# Altium schematic sheet SURFACE.SchDoc
size A4; SheetNumber: 2; SheetTotal: 5
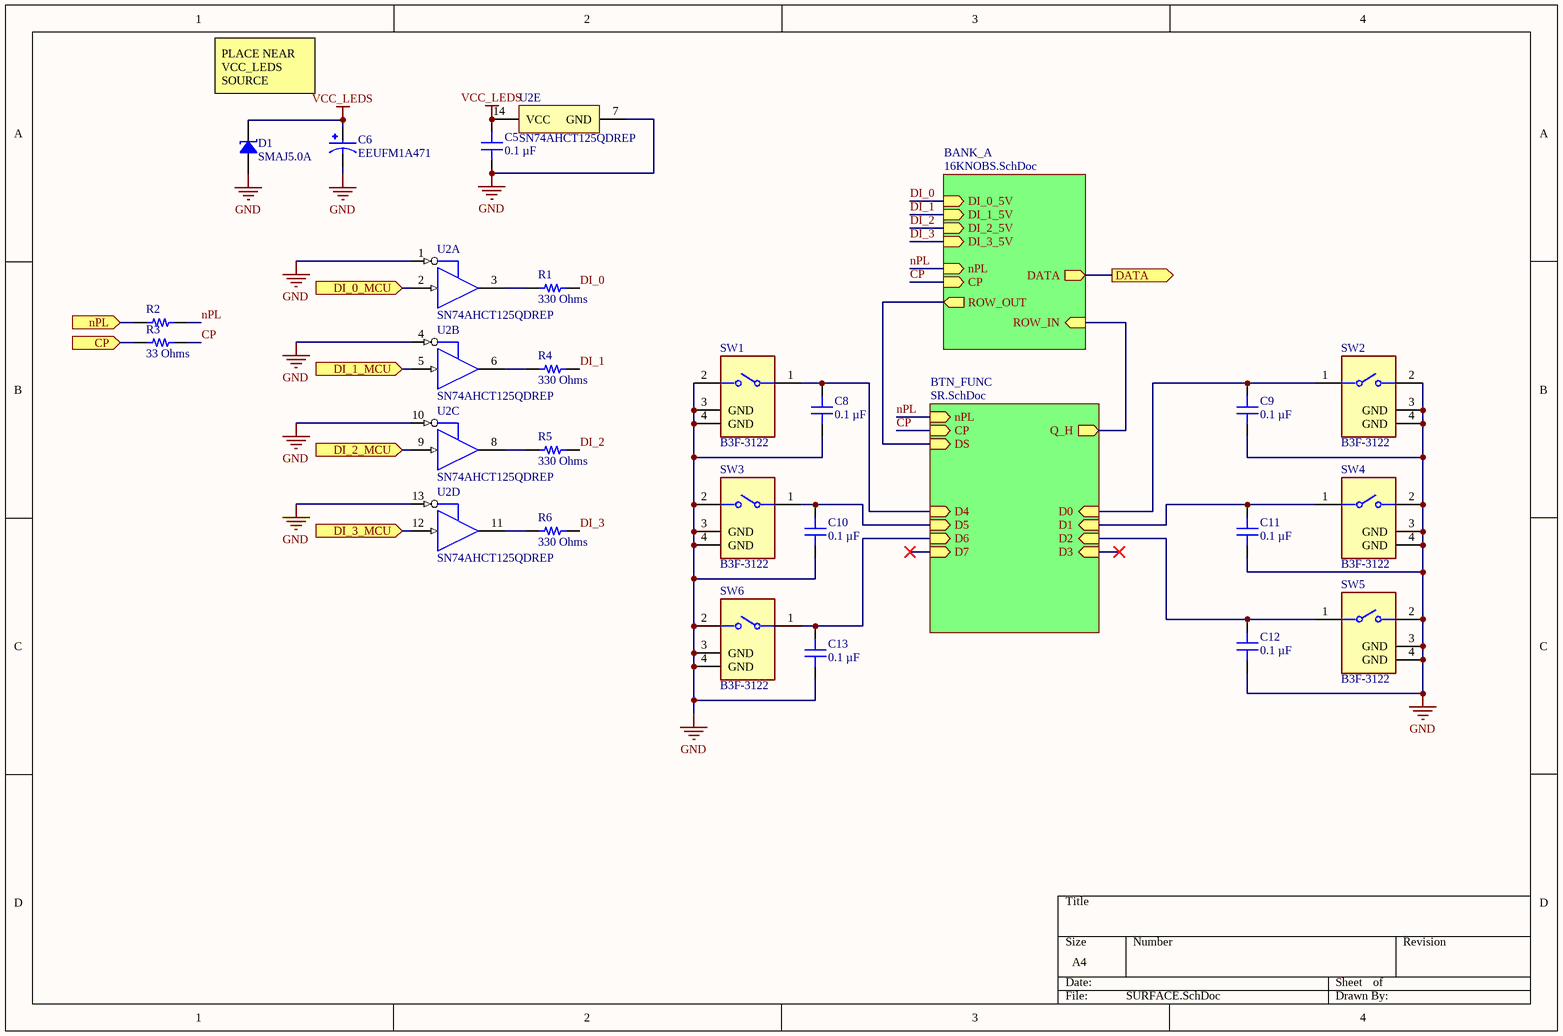
[diagram p0: SURFACE.SchDoc]

## Parts
C5  0.1 µF  [CAP 0603_1608]
C6  EEUFM1A471  [CAPPRD350W60D800H1150]
C8  0.1 µF  [CAP 0603_1608]
C9  0.1 µF  [CAP 0603_1608]
C10  0.1 µF  [CAP 0603_1608]
C11  0.1 µF  [CAP 0603_1608]
C12  0.1 µF  [CAP 0603_1608]
C13  0.1 µF  [CAP 0603_1608]
D1  SMAJ5.0A  [DO214AC SMA]
R1  330 Ohms  [YAGEO RES 0603_1608]
R2  33 Ohms  [YAGEO RES 0603_1608]  (value not drawn)
R3  33 Ohms  [YAGEO RES 0603_1608]
R4  330 Ohms  [YAGEO RES 0603_1608]
R5  330 Ohms  [YAGEO RES 0603_1608]
R6  330 Ohms  [YAGEO RES 0603_1608]
SW1  B3F-3122  [FP-B3F-3122-MFG]
SW2  B3F-3122  [FP-B3F-3122-MFG]
SW3  B3F-3122  [FP-B3F-3122-MFG]
SW4  B3F-3122  [FP-B3F-3122-MFG]
SW5  B3F-3122  [FP-B3F-3122-MFG]
SW6  B3F-3122  [FP-B3F-3122-MFG]
U2  SN74AHCT125QDREP  [D0014A_L]  (parts A,B,C,D,E of 5)

## Sub-sheets
BANK_A = 16KNOBS.SchDoc: DI_0_5V (in), DI_1_5V (in), nPL (in), CP (in), DI_2_5V (in), DI_3_5V (in), DATA (out), ROW_IN (in), ROW_OUT (out)
BTN_FUNC = SR.SchDoc: nPL (in), CP (in), DS (in), Q_H (out), D4 (in), D5 (in), D6 (in), D7 (in), D0 (in), D1 (in), D2 (in), D3 (in)

## Ports
CP (in), DATA (out), DI_0_MCU (in), DI_1_MCU (in), DI_2_MCU (in), DI_3_MCU (in), nPL (in)

## Nets
GND: C5.1 C6.N C8.1 C9.1 C10.1 C11.1 C12.1 C13.1 D1.1 SW1.2 SW1.3(GND) SW1.4(GND) SW2.2 SW2.3(GND) SW2.4(GND) SW3.2 SW3.3(GND) SW3.4(GND) SW4.2 SW4.3(GND) SW4.4(GND) SW5.2 SW5.3(GND) SW5.4(GND) SW6.2 SW6.3(GND) SW6.4(GND) U2.1(1~{OE}) U2.4(2~{OE}) U2.7(GND) U2.10(3~{OE}) U2.13(4~{OE})
VCC_LEDS: C5.2 C6.P D1.2 U2.14(VCC)
CP: R3.2 ; sheet BTN_FUNC/CP, sheet BANK_A/CP
CP: R3.1 ; port CP  [a separate net that carries the same name]
DATA: port DATA, sheet BANK_A/DATA
DI_0: R1.2 ; sheet BANK_A/DI_0_5V
DI_0_MCU: U2.2(1A) ; port DI_0_MCU
DI_1: R4.2 ; sheet BANK_A/DI_1_5V
DI_1_MCU: U2.5(2A) ; port DI_1_MCU
DI_2: R5.2 ; sheet BANK_A/DI_2_5V
DI_2_MCU: U2.9(3A) ; port DI_2_MCU
DI_3: R6.2 ; sheet BANK_A/DI_3_5V
DI_3_MCU: U2.12(4A) ; port DI_3_MCU
nPL: R2.2 ; sheet BTN_FUNC/nPL, sheet BANK_A/nPL
nPL: R2.1 ; port nPL  [a separate net that carries the same name]
NetC8_2: C8.2 SW1.1 ; sheet BTN_FUNC/D4
NetC9_2: C9.2 SW2.1 ; sheet BTN_FUNC/D0
NetC10_2: C10.2 SW3.1 ; sheet BTN_FUNC/D5
NetC11_2: C11.2 SW4.1 ; sheet BTN_FUNC/D1
NetC12_2: C12.2 SW5.1 ; sheet BTN_FUNC/D2
NetC13_2: C13.2 SW6.1 ; sheet BTN_FUNC/D6
NetR1_1: R1.1 U2.3(1Y)
NetR4_1: R4.1 U2.6(2Y)
NetR5_1: R5.1 U2.8(3Y)
NetR6_1: R6.1 U2.11(4Y)
(unnamed): sheet BTN_FUNC/DS, sheet BANK_A/ROW_OUT
(unnamed): sheet BTN_FUNC/Q_H, sheet BANK_A/ROW_IN

## Notes on the sheet
- PLACE NEAR
  VCC_LEDS SOURCE

## Library data of the parts
C5 C8-C13 = CC0603KPX7R7BB104: CAP CER 0.1UF 16V X7R 0603; manufacturer: Yageo; Tolerance: ±10%; Part Number: CC0603KPX7R7BB104; Value: 0.1 µF; Applications: General Purpose; Capacitance: 0.1 µF; componentlink1description: Datasheet; componentlink1url: https://www.yageo.com/upload/media/product/productsearch/datasheet/mlcc/UPY-GPHC_X7R_6.3V-to-50V_18.pdf; componentlink2description: DigiKey Link; componentlink2url: https://www.digikey.com/en/products/detail/yageo/CC0603KPX7R7BB104/2103073; Device Package: 0603 (1608 Metric); lastupdated: 2/9/2024 8:10:09 PM; Lifecycle Status: Active; Minimum Order: 1; Mounting Type: Surface Mount, MLCC; Operating Temperature: -55°C ~ 125°C; Package / Case: 0603 (1608 Metric); packaging: TapeAndReel; partid: 16718; Part Status: Active; price: 0.01; series: CC; Size / Dimension: 0.063" L x 0.031" W (1.60mm x 0.80mm); Supplier 1: DigiKey; Supplier Part Number 1: 311-1335-1-ND; Temperature Coefficient: X7R; Thickness (Max): 0.035" (0.90mm); Voltage - Rated: 16V
C6 = EEUFM1A471: Cap Aluminum Lytic 470uF 10V 20% (8 X 11.5mm) Radial 3.5mm 950mA 3000h 105C Bulk; MP: EEU-FM1A471; MF: Panasonic; Purchase-URL: https://pricing.snapeda.com/search/part/EEU-FM1A471/?ref=eda; SnapEDA_Link: https://www.snapeda.com/parts/EEU-FM1A471/Panasonic/view-part/2301689/?ref=snap; Check_prices: https://www.snapeda.com/parts/EEU-FM1A471/Panasonic/view-part/2301689/?ref=eda; Availability: In Stock; Package: RADIAL-2 Panasonic; Value: *; Price: None
D1 = SMAJ5.0A: TVS DIODE 5VWM 9.2VC DO214AC; Manufacturer: Littelfuse Inc.; Current - Peak Pulse (10/1000µs): 43.5A; Power Line Protection: No; Power - Peak Pulse: 400W; Type: Zener; Unidirectional Channels: 1; Voltage - Breakdown (Min): 6.4V; Voltage - Clamping (Max) @ Ipp: 9.2V; Voltage - Reverse Standoff (Typ): 5V; Part Number: SMAJ5.0A; Applications: General Purpose; ComponentLink1Description: Datasheet; ComponentLink1URL: https://www.littelfuse.com/~/media/electronics/datasheets/tvs_diodes/littelfuse_tvs_diode_smaj_datasheet.pdf.pdf; ComponentLink2Description: DigiKey Link; ComponentLink2URL: https://www.digikey.com/en/products/detail/littelfuse-inc/SMAJ5-0A/762250; LastUpdated: 6/3/2024 7:57:22 PM; Lifecycle Status: Active; Minimum Order: 1; Mounting Type: Surface Mount; Operating Temperature: -65°C ~ 150°C (TJ); Package / Case: DO-214AC, SMA; Packaging: TapeAndReel; PartId: 5719; Part Status: Active; Price: 0.09; Series: SMAJ; Supplier 1: DigiKey; Supplier Part Number 1: SMAJ5.0ALFCT-ND; Supplier Device Package: DO-214AC (SMA)
R1 R4-R6 = RC0603JR-07330RP: RES 330 OHM 5% 1/10W 0603; Manufacturer: Yageo; Power (Watts): 0.1W, 1/10W; Ratings: 7C1 RoHS w/out Exemption (100% Pb-Free); Temperature Coefficient: ±100ppm/°C; Part Number: RC0603JR-07330RP; Value: 330 Ohms; ComponentLink1Description: Datasheet; ComponentLink1URL: http://www.yageo.com/NewPortal/yageodocoutput?fileName=/pdf/R-Chip/PYu-RC_51_RoHS_P_0.pdf; ComponentLink2Description: DigiKey Link; ComponentLink2URL: https://www.digikey.com/en/products/detail/yageo/RC0603JR-07330RP/4935329; Composition: Thick Film; Device Package: 0603 (1608 Metric); Features: Moisture Resistant; Height - Seated (Max): 0.022" (0.55mm); LastUpdated: 7/25/2024 9:19:30 AM; Lifecycle Status: Active; Minimum Order: 1; Number of Terminations: 2; Operating Temperature: -55°C ~ 155°C; Package / Case: 0603 (1608 Metric); Packaging: TapeAndReel; PartId: 9775; Part Status: Active; Price: 0.01; Resistance: 330 Ohms; Series: RC_P; Size / Dimension: 0.063" L x 0.031" W (1.60mm x 0.80mm); Supplier 1: DigiKey; Supplier Part Number 1: YAG1314CT-ND; Supplier Device Package: 0603; Tolerance: ±5%
R2 R3 = RC0603JR-0733RL: RES 33 OHM 5% 1/10W 0603; Manufacturer: Yageo; Power (Watts): 0.1W, 1/10W; Temperature Coefficient: ±100ppm/°C; Part Number: RC0603JR-0733RL; Value: 33 Ohms; ComponentLink1Description: Datasheet; ComponentLink1URL: https://www.yageo.com/upload/media/product/productsearch/datasheet/rchip/PYu-RC_Group_51_RoHS_L_10.pdf; ComponentLink2Description: DigiKey Link; ComponentLink2URL: https://www.digikey.com/en/products/detail/yageo/RC0603JR-0733RL/726771; Composition: Thick Film; Device Package: 0603 (1608 Metric); Features: Moisture Resistant; Height - Seated (Max): 0.022" (0.55mm); LastUpdated: 7/25/2024 9:19:24 AM; Lifecycle Status: Active; Minimum Order: 1; Number of Terminations: 2; Operating Temperature: -55°C ~ 155°C; Package / Case: 0603 (1608 Metric); Packaging: CutTape; PartId: 17082; Part Status: Active; Price: 0.01; Resistance: 33 Ohms; Series: RC_L; Size / Dimension: 0.063" L x 0.031" W (1.60mm x 0.80mm); Supplier 1: DigiKey; Supplier Part Number 1: 311-33GRCT-ND; Supplier Device Package: 0603; Tolerance: ±5%
SW1-SW6 = CMP-08834-000053-1: SWITCH TACTILE SPST-NO 0.05A 24V; Max Current Rating: 50mA; Actuator Type: Standard; Ratings: IP00; Number of Poles: 1; Mechanical Life: 300000Cycles; Illumination Type: Non-Illuminated; Switch Function: Off-Mom; Actuator Color: Grey; Contact Resistance: 100mR; Throw Configuration: SPST; Actuator Length: 1.6mm; Switch Travel: 0.25mm; Operating Force: 1.47N; Weight: 0.25g; Voltage Rating (DC): 24V; Contact Plating: Gold; RoHS Compliant: Yes; Contact Material: Gold; Radiation Hardening: No; Packaging: Bulk; Height: 7.4mm; Min Operating Temperature: -25°C; Electrical Life: 300000Cycles; Depth: 7.85mm; Max Voltage Rating (DC): 24V; Mount: Through Hole; Width: 6.25mm; Current Rating: 50mA; Lead Free: Lead Free; Max Operating Temperature: 70°C; Series: B3F; Contact Current Rating: 50mA; Package Quantity: 1000; Termination: PC Pins; Orientation: Right Angle; Length: 7.3mm
U2 = CMP-0440-00320-3: Enhanced Product Quadruple Bus Buffer Gates With 3-State Outputs, D0014A, LARGE T&R; Manufacturer: Texas Instruments; Generic Part Number: SN74AHCT125-EP; Output Type: CMOS; VCC(Min)(V): 4.5; Input Type: TTL; Rating: HiRel Enhanced Product; ICC @ Nom Voltage(Max)(mA): 0.02; tpd @ Nom Voltage(Max)(ns): 8.5; VCC(Max)(V): 5.5; Voltage(Nom)(V): 5; F @ Nom Voltage(Max)(Mhz): 110; Operating Temperature Range(C): -40 to 125; PackageReference: D0014A; DatasheetVersion: SCLS549; Code_JEDEC: MS-012; PackageVersion: http://www.ti.com/lit/ml/mpds177g/mpds177g.pdf